# EAGLE design CW1 (EAGLE 9.3.2)
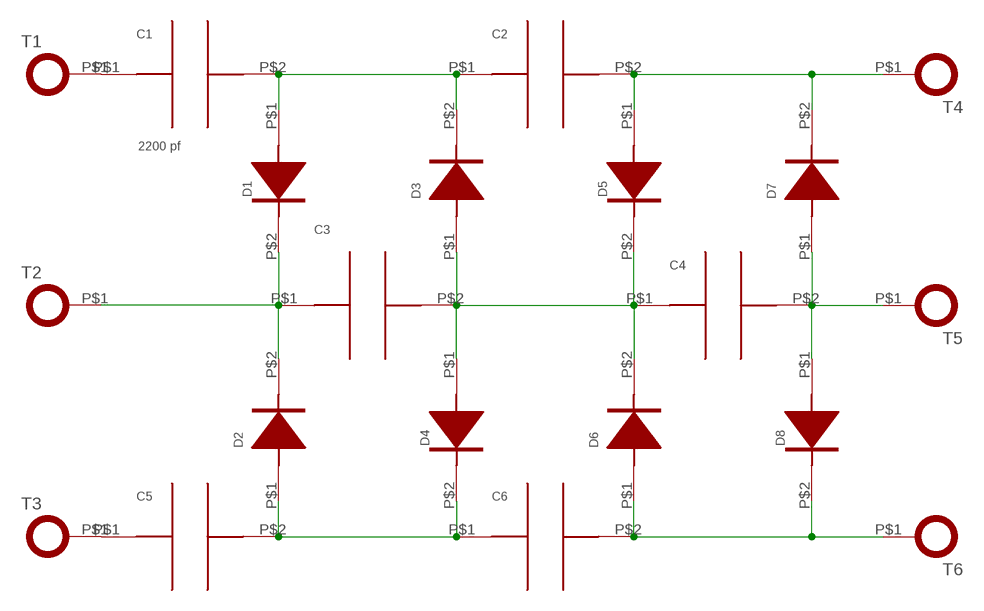
[diagram p0: schematic, sheet 1]

## Parts
C1  2200 pf  HV_CAPACITOR_12MM  [CAP_CT81_12]
C2  HV_CAPACITOR_12MM  [CAP_CT81_12]
C3  HV_CAPACITOR_12MM  [CAP_CT81_12]
C4  HV_CAPACITOR_12MM  [CAP_CT81_12]
C5  HV_CAPACITOR_12MM  [CAP_CT81_12]
C6  HV_CAPACITOR_12MM  [CAP_CT81_12]
D1  DIODE_14MM  [DIODE_14]
D2  DIODE_14MM  [DIODE_14]
D3  DIODE_14MM  [DIODE_14]
D4  DIODE_14MM  [DIODE_14]
D5  DIODE_14MM  [DIODE_14]
D6  DIODE_14MM  [DIODE_14]
D7  DIODE_14MM  [DIODE_14]
D8  DIODE_14MM  [DIODE_14]
T1  TERMINAL_M6  [LUG_SQUARE_M6]
T2  TERMINAL_M6  [LUG_SQUARE_M6]
T3  TERMINAL_M6  [LUG_SQUARE_M6]
T4  TERMINAL_M6  [LUG_SQUARE_M6]
T5  TERMINAL_M6  [LUG_SQUARE_M6]
T6  TERMINAL_M6  [LUG_SQUARE_M6]

## Nets
N$1: C1.P$2 C2.P$1 D1.P$1(ANODE) D3.P$2(CATHODE)
N$2: C3.P$1 D1.P$2(CATHODE) D2.P$2(CATHODE) T2.P$1
N$3: C3.P$2 C4.P$1 D3.P$1(ANODE) D4.P$1(ANODE) D5.P$2(CATHODE) D6.P$2(CATHODE)
N$4: C5.P$2 C6.P$1 D2.P$1(ANODE) D4.P$2(CATHODE)
N$5: C6.P$2 D6.P$1(ANODE) D8.P$2(CATHODE) T6.P$1
N$6: C4.P$2 D7.P$1(ANODE) D8.P$1(ANODE) T5.P$1
N$7: C1.P$1 T1.P$1
N$8: C2.P$2 D5.P$1(ANODE) D7.P$2(CATHODE) T4.P$1
N$9: C5.P$1 T3.P$1

## Library data of the parts
C1-C6 = cwParts:HV_CAPACITOR_12MM: High Voltage Ceramic Capacitor with 12mm pitch.
D1-D8 = cwParts:DIODE_14MM: Generic diode with 14mm footprint.
T1-T6 = cwParts:TERMINAL_M6: Attachment for an M6 terminal

## Board
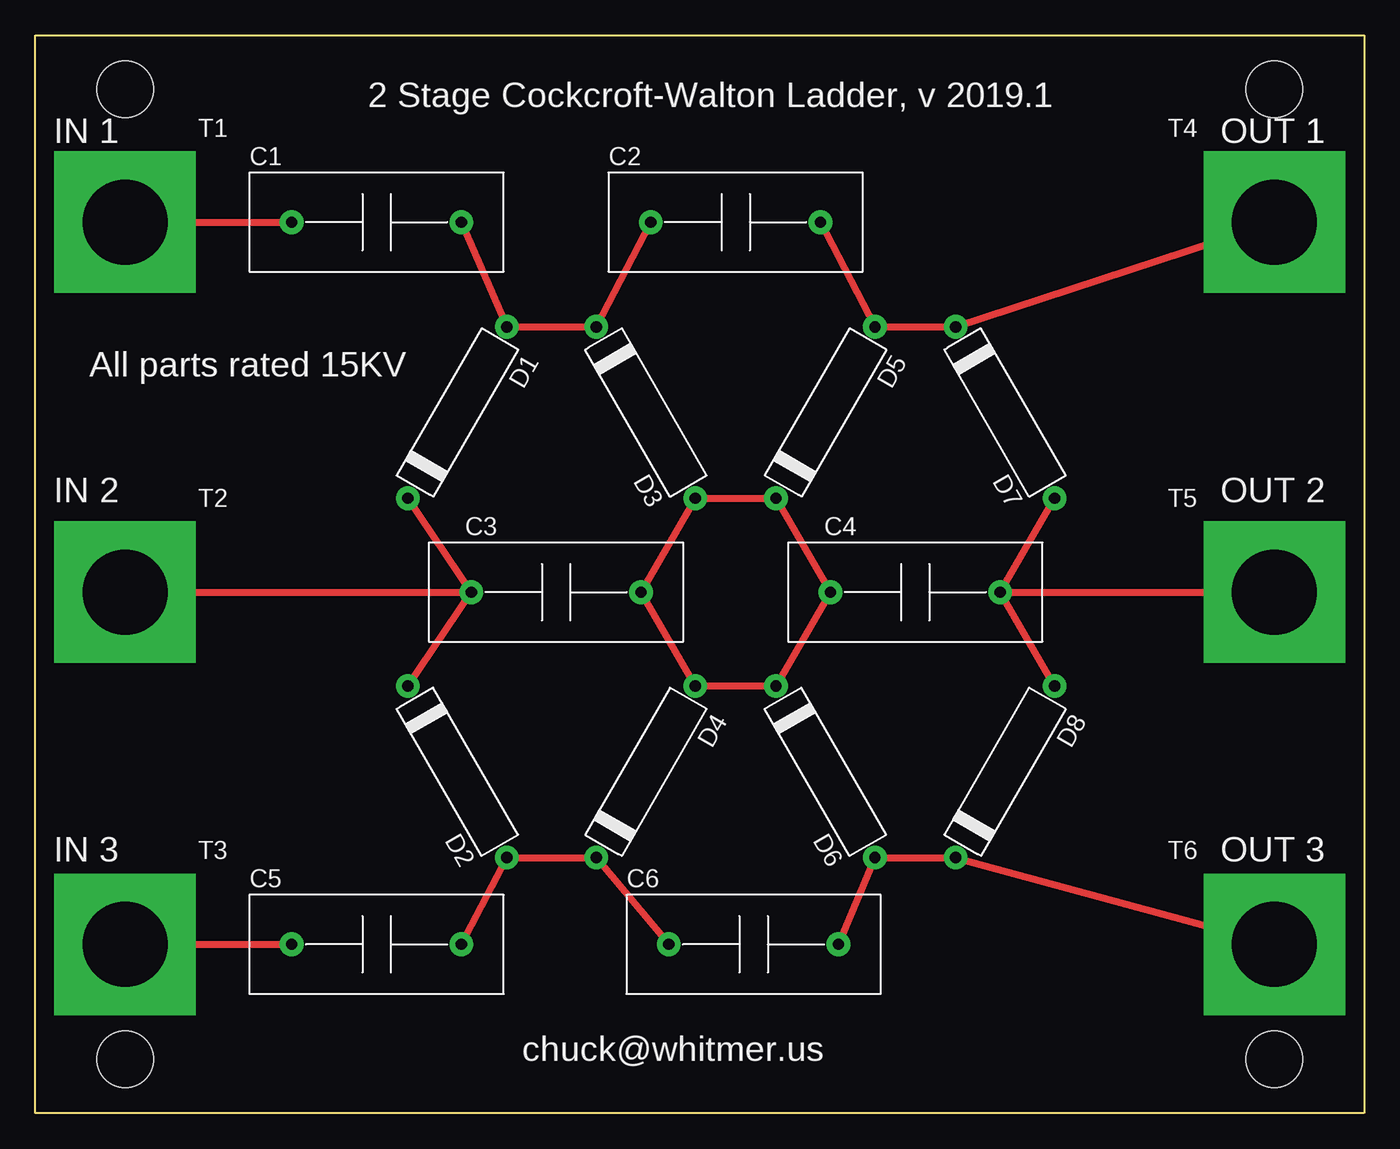
[diagram p1: board, top side]

Size 93.98 x 76.2 mm. Coordinates in mm from the lower left corner, seen from the top.
Outline: 0,0 0,76.2 93.98,76.2 93.98,0 0,0
Copper layers (1*16): Top 0.035mm / dielectric 1.5mm / Bottom 0.035mm
Design rules "default": minimum track width 6mil, minimum drill 0.35mm, track to track 6mil, track to pad 6mil, pad to pad 6mil, via to via 6mil, smd to smd 6mil, copper to edge 40mil, drill to drill 6mil, minimum pad ring 10mil, minimum via ring 8mil, stop-mask expansion 4mil, vias tented up to drill 0mil, thermal gap 10mil
Holes 4 mm at 6.35,72.39 6.35,3.81 87.63,3.81 87.63,72.39

### Footprints (pad centres in the part's own frame; a part is rotated, then mirrored left to right if it is on the bottom)
CAP_CT81_12 = drill 0.8 pad 1.676: P$1 -6,0; P$2 6,0
DIODE_14 = drill 0.8 pad 1.676: P$1 -7,0; P$2 7,0
LUG_SQUARE_M6 = drill 6 pad 10 square: P$1 0,0

### Placement (x,y rotation side)
C1  24.13,62.99 0 top
C2  49.53,62.99 0 top
C3  36.83,36.83 0 top
C4  62.23,36.83 0 top
C5  24.13,11.94 0 top
C6  50.8,11.94 0 top
D1  29.84,49.53 240 top
D2  29.84,24.13 120 top
D3  43.18,49.53 120 top
D4  43.18,24.13 240 top
D5  55.88,49.53 240 top
D6  55.88,24.13 120 top
D7  68.58,49.53 120 top
D8  68.58,24.13 240 top
T1  6.35,62.99 0 top
T2  6.35,36.83 0 top
T3  6.35,11.94 0 top
T4  87.63,62.99 0 top
T5  87.63,36.83 0 top
T6  87.63,11.94 0 top

### Tracks (layer width: path | path; a pad name or v marks a point on that pad's centre or on a via)
N$1
  Top 0.508: C1.P$2 D1.P$1 D3.P$2 C2.P$1
N$2
  Top 0.508: T2.P$1 C3.P$1 | D1.P$2 C3.P$1 | D2.P$2 C3.P$1
N$3
  Top 0.508: D3.P$1 D5.P$2 C4.P$1 D6.P$2 D4.P$1 C3.P$2 D3.P$1
N$4
  Top 0.508: C5.P$2 D2.P$1 D4.P$2 C6.P$1
N$5
  Top 0.508: C6.P$2 D6.P$1 D8.P$2 T6.P$1
N$6
  Top 0.508: D7.P$1 C4.P$2 | C4.P$2 D8.P$1 | C4.P$2 T5.P$1
N$7
  Top 0.508: T1.P$1 C1.P$1
N$8
  Top 0.508: C2.P$2 D5.P$1 D7.P$2 T4.P$1
N$9
  Top 0.508: T3.P$1 C5.P$1

### Text on the board
tPlace: 2 Stage Cockcroft-Walton Ladder, v 2019.1 | IN 1 | OUT 1 | All parts rated 15KV | IN 2 | OUT 2 | IN 3 | OUT 3 | chuck@whitmer.us